# EAGLE design power_switcher (EAGLE 8.4.0)
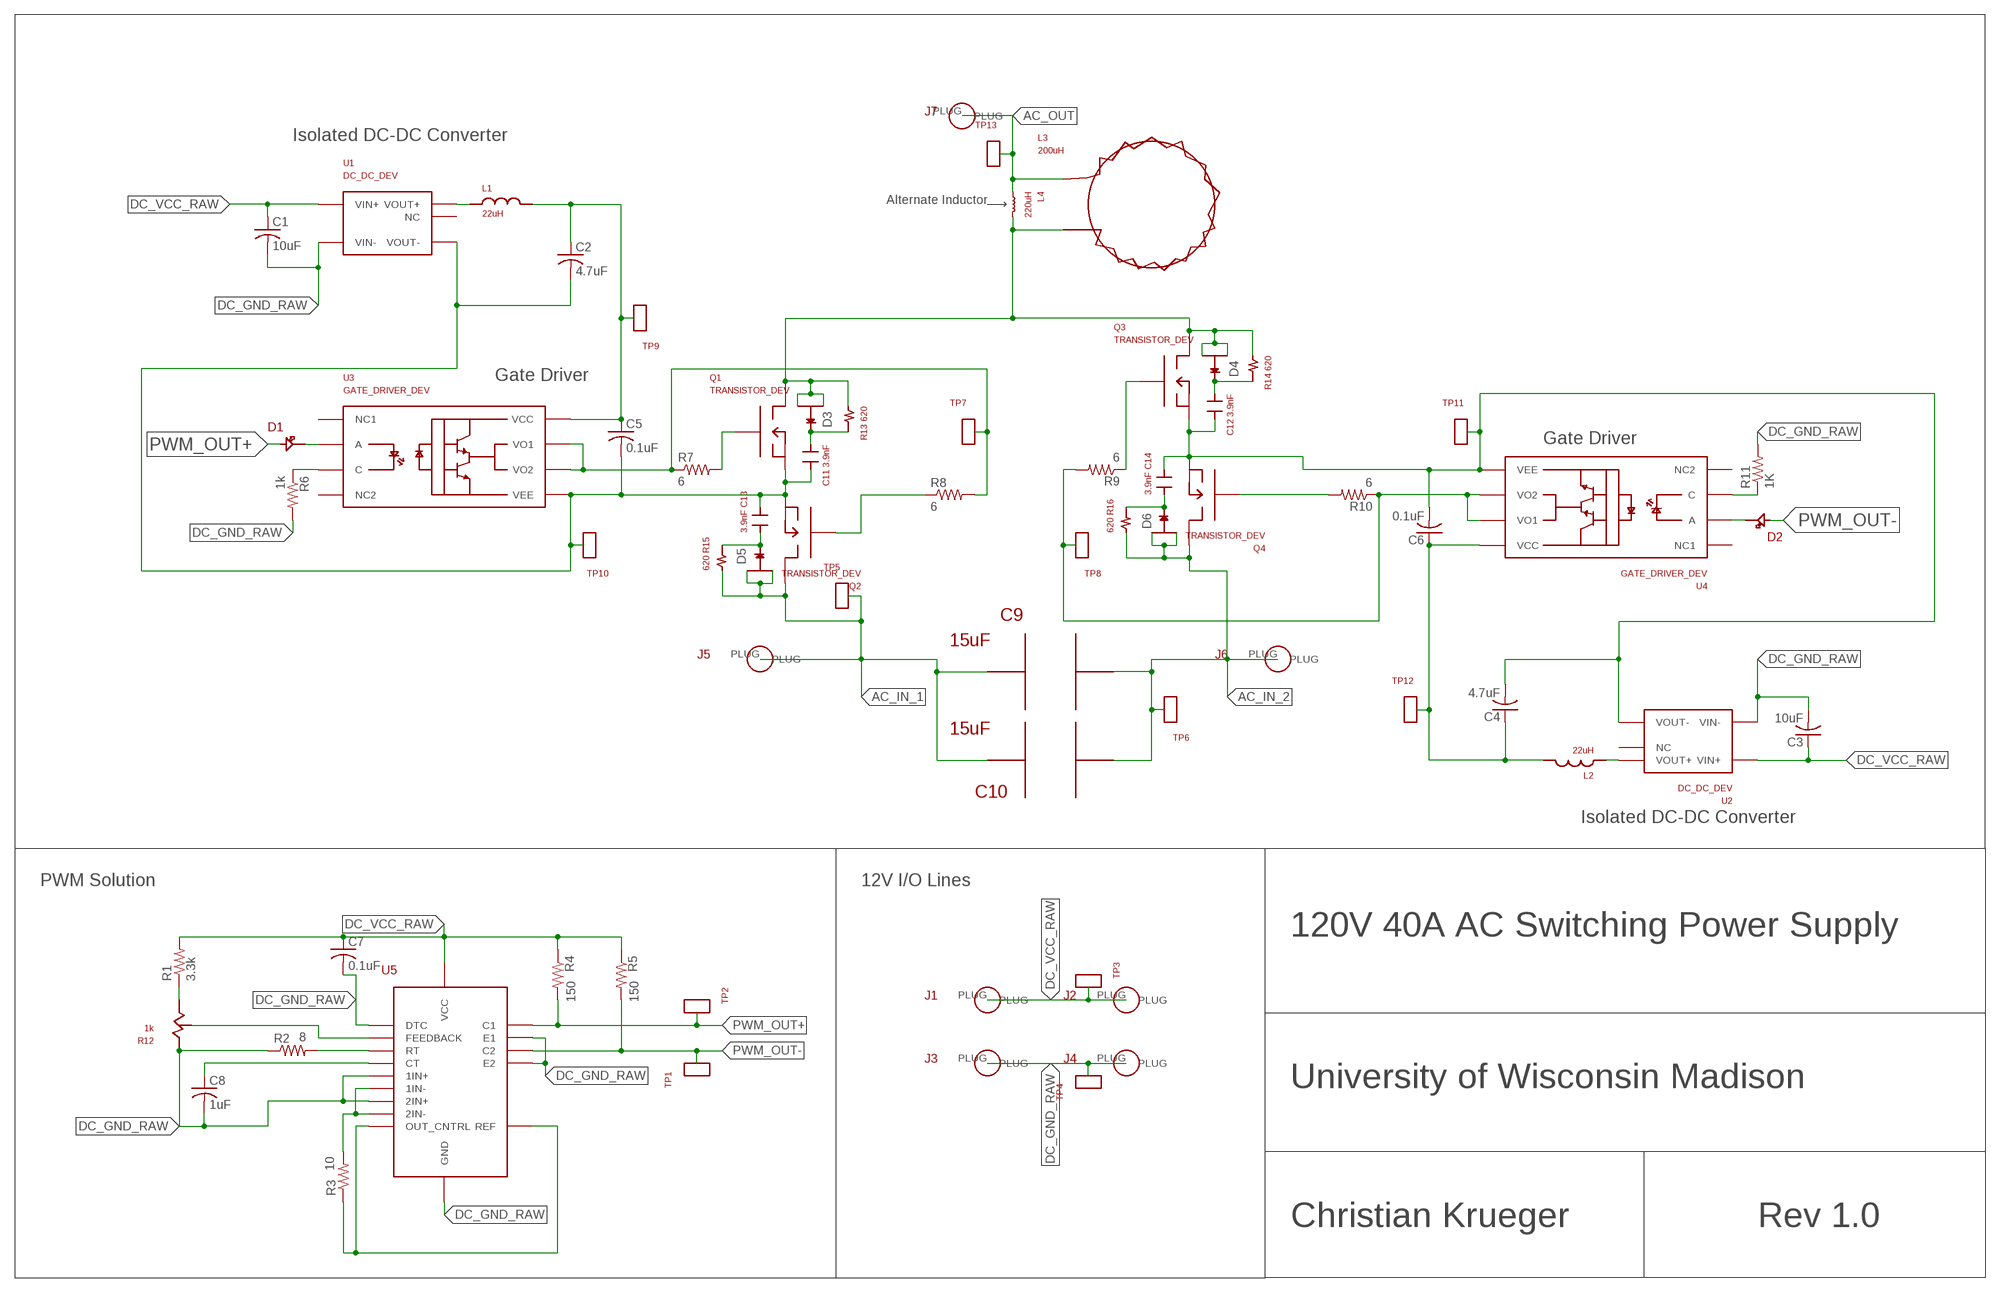
[diagram p0: schematic, sheet 1]

## Parts
C1  10uF  C-USC0805  [C0805]
C2  4.7uF  C-USC0805  [C0805]
C3  10uF  C-USC0805  [C0805]
C4  4.7uF  C-USC0805  [C0805]
C5  0.1uF  C-USC0805  [C0805]
C6  0.1uF  C-USC0805  [C0805]
C7  0.1uF  C-USC0805  [C0805]
C8  1uF  C-USC0805  [C0805]
C9  15uF  BIG_AS_CAP_DEV  [BIG_ASS_CAP_PKG]
C10  15uF  BIG_AS_CAP_DEV  [BIG_ASS_CAP_PKG]
C11  3.9nF  GEN_CAP  [0805_GEN_PKG]
C12  3.9nF  GEN_CAP  [0805_GEN_PKG]
C13  3.9nF  GEN_CAP  [0805_GEN_PKG]
C14  3.9nF  GEN_CAP  [0805_GEN_PKG]
D1  LED_DEV  [0805_PKG]
D2  LED_DEV  [0805_PKG]
D3  D2PAK_DIODE_DEV  [D2PAK_PKG]
D4  D2PAK_DIODE_DEV  [D2PAK_PKG]
D5  D2PAK_DIODE_DEV  [D2PAK_PKG]
D6  D2PAK_DIODE_DEV  [D2PAK_PKG]
J1  BANNANA_DEV  [BANNANA_PKG]
J2  BANNANA_DEV  [BANNANA_PKG]
J3  BANNANA_DEV  [BANNANA_PKG]
J4  BANNANA_DEV  [BANNANA_PKG]
J5  BANNANA_DEV  [BANNANA_PKG]
J6  BANNANA_DEV  [BANNANA_PKG]
J7  BANNANA_DEV  [BANNANA_PKG]
L1  22uH  0805IND_DEV  [0805RES_DEV]
L2  22uH  0805IND_DEV  [0805RES_DEV]
L3  200uH  BIG_ASS_INDUCTOR  [BIG_ASS_INDUCTOR_PKG]
L4  220uH  ALT_IND_DEV  [ALT_IND_PKG]
Q1  TRANSISTOR_DEV  [TRANSISTOR_PKG]
Q2  TRANSISTOR_DEV  [TRANSISTOR_PKG]
Q3  TRANSISTOR_DEV  [TRANSISTOR_PKG]
Q4  TRANSISTOR_DEV  [TRANSISTOR_PKG]
R1  3.3k  R-US_M0805  [M0805]
R2  8  R-US_M0805  [M0805]
R3  10  R-US_M0805  [M0805]
R4  150  R-US_M0805  [M0805]
R5  150  R-US_M0805  [M0805]
R6  1k  R-US_M0805  [M0805]
R7  6  R-US_M0805  [M0805]
R8  6  R-US_M0805  [M0805]
R9  6  R-US_M0805  [M0805]
R10  6  R-US_M0805  [M0805]
R11  1K  R-US_M0805  [M0805]
R12  1k  SLIDE_POT_DEV  [POT_SLIDER_PKG]
R13  620  2512_RES  [2512_PKG]
R14  620  2512_RES  [2512_PKG]
R15  620  2512_RES  [2512_PKG]
R16  620  2512_RES  [2512_PKG]
TP1  TEST_POINT  [0805_GEN_PKG]
TP2  TEST_POINT  [0805_GEN_PKG]
TP3  TEST_POINT  [0805_GEN_PKG]
TP4  TEST_POINT  [0805_GEN_PKG]
TP5  TEST_POINT  [0805_GEN_PKG]
TP6  TEST_POINT  [0805_GEN_PKG]
TP7  TEST_POINT  [0805_GEN_PKG]
TP8  TEST_POINT  [0805_GEN_PKG]
TP9  TEST_POINT  [0805_GEN_PKG]
TP10  TEST_POINT  [0805_GEN_PKG]
TP11  TEST_POINT  [0805_GEN_PKG]
TP12  TEST_POINT  [0805_GEN_PKG]
TP13  TEST_POINT  [0805_GEN_PKG]
U1  DC_DC_DEV  [DC_DC_PKG]
U2  DC_DC_DEV  [DC_DC_PKG]
U3  GATE_DRIVER_DEV  [GATE_DRIVER_PKG]
U4  GATE_DRIVER_DEV  [GATE_DRIVER_PKG]
U5  PWM_DRIVER_DEV  [PWM_DRIVER_PKG]

## Nets
AC_IN_1: C9.P$1 C10.P$1 D5.IN1 D5.IN2 J5.PLUG Q2.D(DRAIN) R15.P$1 TP5.P$1
AC_IN_2: C9.P$2 C10.P$2 D6.IN1 D6.IN2 J6.PLUG Q4.D(DRAIN) R16.P$1 TP6.P$1
AC_OUT: J7.PLUG L3.P$1 L4.P$1 TP13.P$1
DC_GND_RAW: C1.2 C3.2 C7.2 C8.2 J3.PLUG J4.PLUG R2.1 R6.2 R11.2 R12.3 TP4.P$1 U1.-VIN(VIN-) U2.-VIN(VIN-) U5.P$1(1IN+) U5.P$4(DTC) U5.P$7(GND) U5.P$9(E1) U5.P$10(E2) U5.P$16(2IN+)
DC_VCC_RAW: C1.1 C3.1 C7.1 J1.PLUG J2.PLUG R1.2 R4.1 R5.1 TP3.P$1 U1.+VIN(VIN+) U2.+VIN(VIN+) U5.P$12(VCC)
N$1: C4.1 C6.1 L2.R TP12.P$1 U4.VCC
N$2: C2.1 C5.1 L1.R TP9.P$1 U3.VCC
N$3: C4.2 C6.2 C12.P$2 C14.P$2 Q3.S(SOURCE) Q4.S(SOURCE) TP11.P$1 U2.-VOUT(VOUT-) U4.VEE
N$4: R1.1 R12.1
N$5: L2.L U2.+VOUT(VOUT+)
N$6: L1.L U1.+VOUT(VOUT+)
N$7: D1.P$2 U3.A
N$8: R12.2(VAR) U5.P$3(FEEDBACK)
N$10: R3.1 U5.P$13(OUT_CNTRL) U5.P$14(REF)
N$11: R2.2 U5.P$6(RT)
N$12: C8.1 U5.P$5(CT)
N$13: R3.2 U5.P$2(1IN-) U5.P$15(2IN-)
N$14: C2.2 C5.2 C11.P$2 C13.P$2 Q1.S(SOURCE) Q2.S(SOURCE) TP10.P$1 U1.-VOUT(VOUT-) U3.VEE
N$15: R7.1 R8.2 TP7.P$1 U3.VO1 U3.VO2
N$16: R11.1 U4.C
N$17: R6.1 U3.C
N$18: Q1.G(GATE) R7.2
N$20: Q2.G(GATE) R8.1
N$21: D2.P$2 U4.A
N$22: R9.2 R10.1 TP8.P$1 U4.VO1 U4.VO2
N$23: Q4.G(GATE) R10.2
N$24: Q3.G(GATE) R9.1
N$27: C11.P$1 D3.OUT R13.P$2
N$30: C12.P$1 D4.OUT R14.P$2
N$33: C13.P$1 D5.OUT R15.P$2
N$36: C14.P$1 D6.OUT R16.P$2
PRE_AC_OUT: D3.IN1 D3.IN2 D4.IN1 D4.IN2 L3.P$2 L4.P$2 Q1.D(DRAIN) Q3.D(DRAIN) R13.P$1 R14.P$1
PWM_OUT+: D1.P$1 R4.2 TP2.P$1 U5.P$8(C1)
PWM_OUT-: D2.P$1 R5.2 TP1.P$1 U5.P$11(C2)
Unconnected: U1.NC U2.NC U3.NC1 U3.NC2 U4.NC1 U4.NC2

## Notes on the sheet
- Isolated DC-DC Converter
- Alternate Inductor
- Gate Driver
- Gate Driver
- Isolated DC-DC Converter
- PWM Solution | 12V I/O Lines
- 120V 40A AC Switching Power Supply
- University of Wisconsin Madison
- Christian Krueger | Rev 1.0

## Library data of the parts
C1-C8 = adafruit:C-US: CAPACITOR, American symbol
C9 C10 = power_switcher:BIG_AS_CAP_DEV
C11-C14 = power_switcher:GEN_CAP
D1 D2 = power_switcher:LED_DEV
D3-D6 = blizzard_common_1:D2PAK_DIODE_DEV
J1-J7 = power_switcher:BANNANA_DEV
L1 L2 = apple:0805IND_DEV
L3 = power_switcher:BIG_ASS_INDUCTOR
L4 = power_switcher:ALT_IND_DEV
Q1-Q4 = power_switcher:TRANSISTOR_DEV
R1-R11 = adafruit:R-US_: RESISTOR, American symbol
R12 = power_switcher:SLIDE_POT_DEV
R13-R16 = power_switcher:2512_RES
TP1-TP13 = power_switcher:TEST_POINT
U1 U2 = power_switcher:DC_DC_DEV
U3 U4 = power_switcher:GATE_DRIVER_DEV
U5 = power_switcher:PWM_DRIVER_DEV

## Board
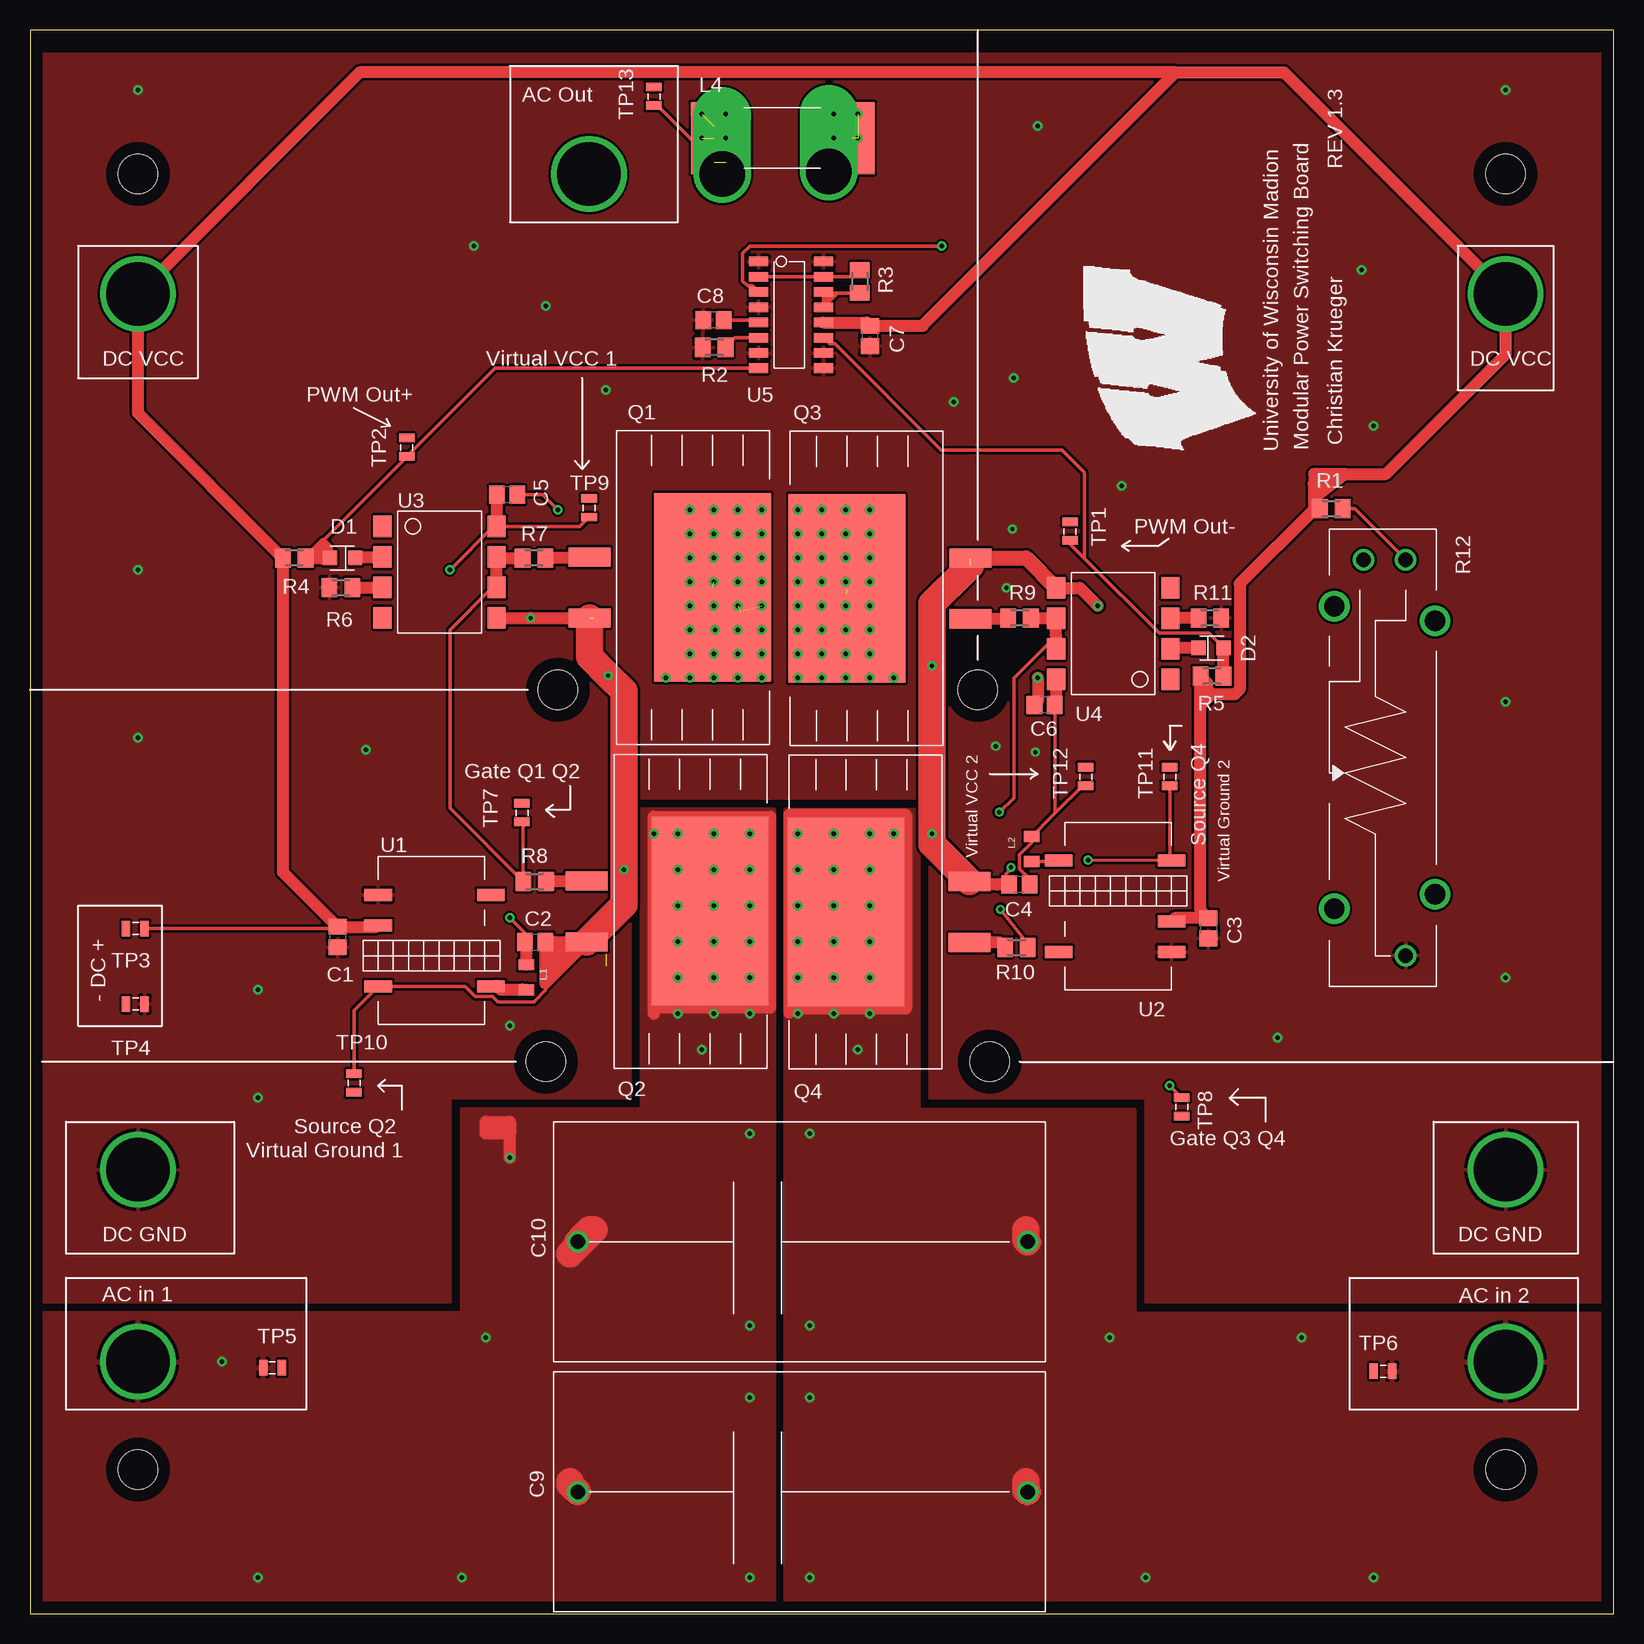
[diagram p1: board, top side]
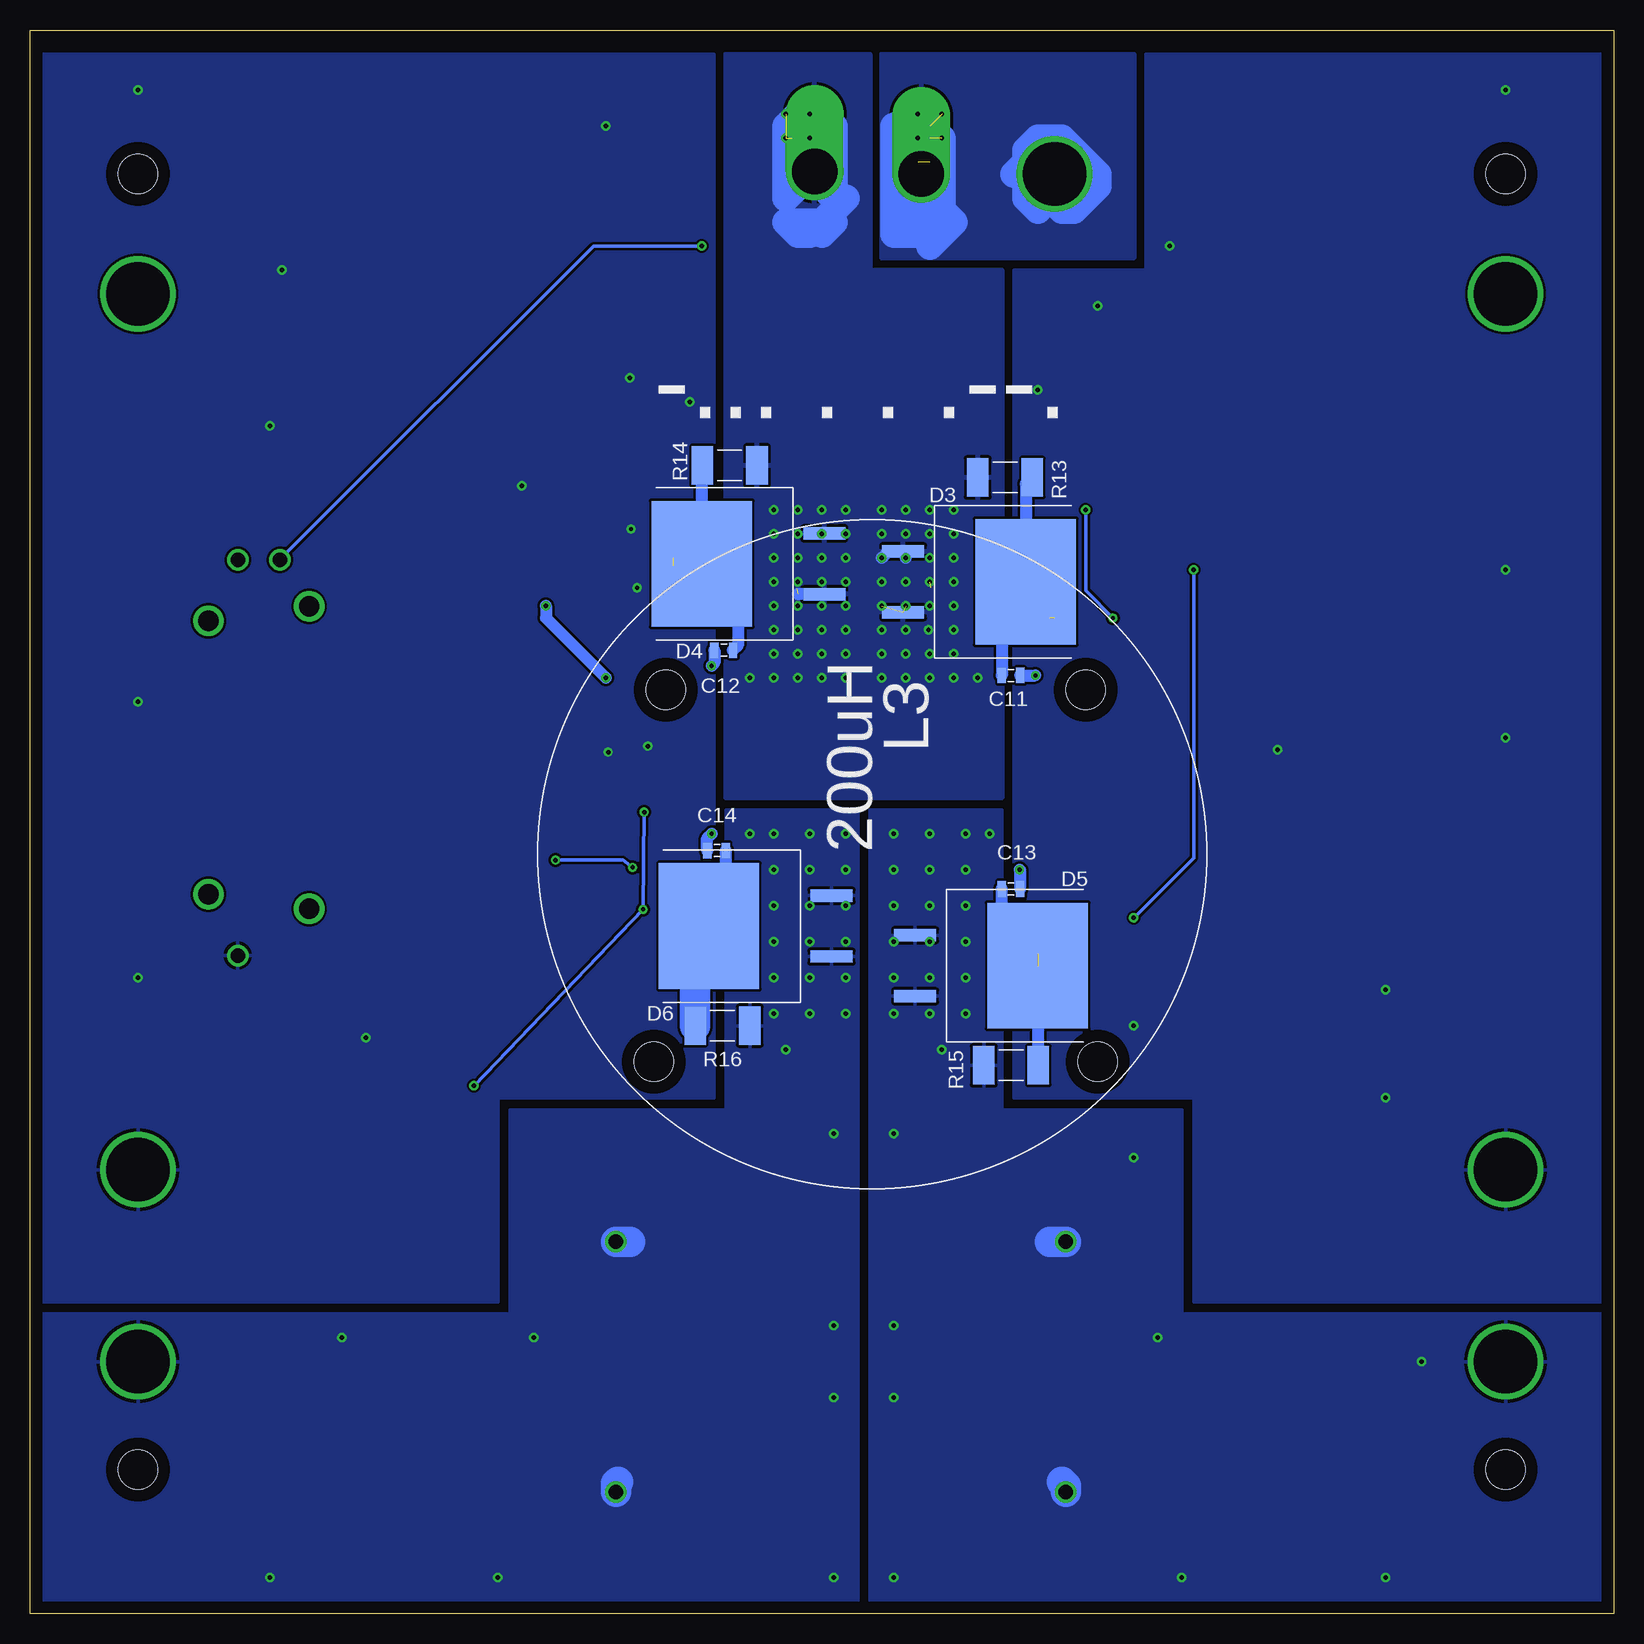
[diagram p2: board, bottom side, seen from below]

Size 132 x 132 mm. Coordinates in mm from the lower left corner, seen from the top.
Outline: 0,0 132,0 132,132 0,132 0,0
Copper layers (1*16): Top 0.035mm / dielectric 1.5mm / Bottom 0.035mm
Design rules "default *": minimum track width 10mil, minimum drill 13mil, track to track 8mil, track to pad 8mil, pad to pad 8mil, via to via 8mil, smd to smd 8mil, copper to edge 40mil, drill to drill 8mil, minimum pad ring 10mil, minimum via ring 8mil, stop-mask expansion 4mil, vias tented up to drill 0mil, thermal gap 10mil
Holes 3.3 mm at 43,46 80,46 79,77 44,77 9,12 123,12 123,120 9,120

### Footprints (pad centres in the part's own frame; a part is rotated, then mirrored left to right if it is on the bottom)
C0805 = smd 1.3 x 1.5: 1 -0.85,0; 2 0.85,0
BIG_ASS_CAP_PKG = drill 1.2: P$1 0,0; P$2 37.5,0
0805_GEN_PKG = smd 0.7 x 1.3: P$1 0,0; P$2 1.55,0
0805_PKG = smd 1.2 x 1.2: P$1 0,0; P$2 2.1,0
D2PAK_PKG = smd 1.016 x 3.504: IN1 -2.54,-10.213; IN2 2.54,-10.213 | smd 10.49 x 8.38: OUT 0,0
BANNANA_PKG = drill 5.31: PLUG 0,0
0805RES_DEV = smd 0.9 x 1.3: L -1.05,0; R 1.05,0
BIG_ASS_INDUCTOR_PKG = drill 3.8 offset: P$1 -56.7,4.1; P$2 -56.9,-4.8
ALT_IND_PKG = smd 3.8 x 6: P$1 0,0; P$2 11.5,0
TRANSISTOR_PKG = smd 9.75 x 15.7: D 0,0 | smd 3.5 x 1.6: G 10.275,-2.54; S 10.275,2.54
M0805 = smd 1.3 x 1.6: 1 -0.95,0; 2 0.95,0
POT_SLIDER_PKG = drill 1.2: 1 0,0; 2 0,-3.5; 3 33,0 | drill 1.7: P$1 5.1,2.45; P$2 27.9,2.45; P$4 3.9,-5.95; P$5 29.1,-5.95
2512_PKG = smd 1.8 x 3.2: P$1 0,0; P$2 4.55,0
DC_DC_PKG = smd 1 x 2.3: +VIN 2.54,0; +VOUT 7.62,9.4; -VIN 0,0; -VOUT 7.62,0; NC 0,9.4
GATE_DRIVER_PKG = smd 1.525 x 1.78: A 0,5.08; C 0,2.54; NC1 0,7.62; NC2 0,0; VCC 9.525,7.62; VEE 9.525,0; VO1 9.525,5.08; VO2 9.525,2.54
PWM_DRIVER_PKG = smd 0.8 x 1.6: P$1 0,0; P$2 1.27,0; P$3 2.54,0; P$4 3.81,0; P$5 5.08,0; P$6 6.35,0; P$7 7.62,0; P$8 8.89,0; P$9 8.89,5.4; P$10 7.62,5.4; P$11 6.35,5.4; P$12 5.08,5.4; P$13 3.81,5.4; P$14 2.54,5.4; P$15 1.27,5.4; P$16 0,5.4

### Placement (x,y rotation side)
C1  25.64,56.39 270 top
C2  42.11,55.99 0 top
C3  98.23,57.12 270 top
C4  82.47,60.77 180 top
C5  39.77,93.27 0 top
C6  84.58,75.73 180 top
C7  70,106.5 270 top
C8  56.97,107.81 180 top
C9  45.65,10.13 0 top
C10  45.65,31 0 top
C11  51,78.2 0 bottom
C12  73.4,80.3 180 bottom
C13  51,60.4 0 bottom
C14  74,63.6 180 bottom
D1  25,88 0 top
D2  99.5,80.5 180 top
D3  49,86 270 bottom
D4  76,87.5 90 bottom
D5  48,54 270 bottom
D6  75.4,57.3 90 bottom
J1  9,110 0 top
J2  123,110 0 top
J3  123,37 0 top
J4  9,37 0 top
J5  9,21 0 top
J6  123,21 0 top
J7  46.59,120 0 top
L1  41.36,53.03 90 top
L2  83.5,63.73 90 top
L3  61.8,63.3 270 bottom
L4  57,123 0 top
Q1  56.9,85.53 180 top
Q2  56.68,58.53 180 top
Q3  68.1,85.45 0 top
Q4  68.04,58.47 0 top
R1  108.47,92.11 180 top
R2  57.03,105.54 0 top
R3  69.16,111.03 90 top
R4  22.03,87.99 0 top
R5  98.53,78.14 0 top
R6  25.91,85.53 180 top
R7  42.01,87.97 0 top
R8  42.07,61.03 180 top
R9  82.49,82.97 0 top
R10  82.23,55.53 180 top
R11  98.35,82.97 0 top
R12  114.68,87.85 270 top
R13  53,94.7 0 bottom
R14  71.4,95.7 180 bottom
R15  52.5,45.7 0 bottom
R16  72,49 180 bottom
TP1  86.7,89.45 90 top
TP2  31.4,96.45 90 top
TP3  9.55,57.1 180 top
TP4  9.55,50.8 180 top
TP5  19.45,20.5 0 top
TP6  113.55,20.2 180 top
TP7  41,66 90 top
TP8  96,43 270 top
TP9  46.6,91.4 90 top
TP10  27,45 270 top
TP11  95,69 90 top
TP12  88,69 90 top
TP13  52,125.7 90 top
U1  29.02,59.91 270 top
U2  95.15,55.15 90 top
U3  29.37,83 0 top
U4  95.06,85.5 180 top
U5  60.74,112.7 270 top

### Tracks (layer width: path | path; a pad name or v marks a point on that pad's centre or on a via)
AC_IN_1  (via drill 0.35)
  Top 1.016: 52,50 52,66.4 61.7,66.4 61.7,50.5 52.4,50.5 52.4,51 | 40,40 40,41 38,41 38,40 40,40 | v40,38 40,40
  Top 2.3: C10.P$1 46.65,32 47,32 45,30 | C9.P$1 45,10.78 45,11
  Bottom 2.54: C10.P$1 47,31 | C9.P$1 45.65,10.65 46,11
  other vias: 52,65 60,65 60,53 54,53 54,59 60,59 57,59 57,65 57,53 36,3 16,21 19,3 60,3 60,18 60,24 60,40 56,47 38,23 60,62 57,62 54,62 54,65 60,56 57,56 54,56 54,50 57,50 60,50
  pour Top: 1,0 62,0 62,67 51,67 51,42 36,42 36,25 1,25
  pour Bottom: 62,0 62,67 51,67 51,42 36,42 36,25 1,25 1,0
AC_IN_2  (via drill 0.35)
  Top 1.016: 63.3,50.1 63.3,66.6 73,66.6 73,50.4 64,50.4 64,50.2
  Top 2.3: C9.P$2 83,10.28 83,11 | C10.P$2 83,31.15 83,32
  Bottom 2.54: C10.P$2 82,31 | C9.P$2 83.15,10.85 83,11
  other vias: 64,65 67,65 70,65 70,59 67,59 64,59 64,50 67,50 70,50 65,40 65,24 65,18 65,3 93,3 112,3 106,23 90,23 69,47 64,53 67,53 70,53 64,56 67,56 70,56 64,62 67,62 70,62 72,65
  pour Top: 63,0 63,67 74,67 74,42 92,42 92,25 131,25 131,0
  pour Bottom: 63,0 63,67 74,67 74,42 92,42 92,25 131,25 131,0
AC_OUT  (via drill 0.35)  (3 unrouted)
  Top 0.305: TP13.P$1 52.3,125.7 57,121
  Bottom 2.3: 56,122 56,117 55,116 57,114 57,116.3 L3.P$1 58,117.3 | 56,122 v56,123 57,124 60,124 60,115 58,115 59,116 59,122 56,122 | 58,117.3 58,121 | 58,117.3 58,116 | J7.PLUG 48,118.59 48,117 49,118 49,122 48,123 46,123 43,120 43,119 45,117 46,117 | 46,117 45,118 45,120 46,121 47,121 46,120 46,117 | 46,117 49,120 | 49,120 48,121 49,121 50,120 49,120
  other vias: 56,125 58,125 58,123
  pour Bottom: 61,113 61,130 40,130 40,113
DC_GND_RAW  (via drill 0.35)
  other vias: 104,48 77,101 84,124 123,127 43,109 9,127 19,43 28,72 91,94 112,99 81.9,90.4 111,112 82,103 123,76 123,53 9,73 19,52 9,87 48,102 37,114 81.4,85.5 80.5,72.3 83.8,71.8 40,49
  pour Top: 35,26 1,26 1,130 131,130 131,26 93,26 93,43 75,43 75,68 50,68 50,43 35,43
  pour Bottom: 1,130 39,130 39,112 50,112 50,43 35,43 35,26 1,26
  pour Bottom: 75,43 75,130 131,130 131,26 93,26 93,43
DC_VCC_RAW
  Top 0.305: TP3.P$1 25.5,57.1 C1.1
  Top 1.016: U1.+VIN 28.89,57.24 C1.1 21.08,61.8 R4.1 9,100.07 J1.PLUG 27.48,128.48 95.54,128.48 | 95.54,128.48 104.52,128.48 J2.PLUG 123,105 113,95 109.56,95 | 97.58,75.67 97.58,58.62 C3.1 95.43,57.97 U2.+VIN | 97.58,75.67 R5.1 98.12,77.6 98.12,77.05 98.53,76.63 | 98.53,76.63 100.42,76.63 100.84,77.05 100.84,85.84 107,92 107,94.18 107.04,94.22 | 97.58,75.67 98.53,76.63 | U5.P$12 69.73,107.62 C7.1 | C7.1 70.35,107.35 | C7.1 74.41,107.35 95.54,128.48 | 107.04,94.22 107.04,95 109,95 | 107.04,94.22 107.04,93.06 | 109.56,95 109,95 | 107.04,93.06 107.3,92.56 R1.2 | 107.04,93.06 109.56,95 | 109,95 107.04,94.22
N$1
  Top 0.305: C4.1 83.32,61.26 82.49,62.08 82.49,63.28 83.5,64.28 L2.R 85.25,66.53 85.43,66.71 | 85.43,66.71 C6.1 | TP12.P$1 87.72,69 85.43,66.71
  Top 1.016: U4.VCC 85.53,75.83 C6.1
N$2  (via drill 0.35)
  Top 0.305: v35,87 38.62,90.62 U3.VCC 45.82,90.62 TP9.P$1 | v40,58 41.36,56.64 41.36,55.89
  Top 1.016: C5.1 38.9,93.25 U3.VCC | L1.R 41.36,55.89 C2.1
  Bottom 0.305: v40,58 35,63 v35,87
N$3  (via drill 0.35)  (1 unrouted)
  Top 0.305: 94.89,62.77 U2.-VOUT | 94.89,62.77 v88.2,62.8 | v81.76,62.2 81.76,62.11 80.62,60.77 | TP11.P$1 95,62.88 94.89,62.77
  Top 1.016: C4.2 80.62,60.77 78.56,60.77 Q4.S | U4.VEE 87.5,85.5 v89,84 | v84,78 84,76 C6.2
  Top 1.27: Q3.S 83.05,87.99 U4.VEE
  Top 2.3: Q4.S 75.18,64.14 v75.18,65 v75.18,79 75.18,84.18 78,87 78.38,87.38
  Bottom 0.305: v88.2,62.8 82.56,62.8 v81.76,62.2
  Bottom 1.016: v89,84 89,83 v84,78 | C14.P$2 75.55,64.63 v75.18,65 | C12.P$2 74.95,79.23 v75.18,79
N$4
  Top 0.305: 109.68,91.85 R1.1 110.42,92.11 R12.1
N$5
  Top 0.305: U2.+VOUT 85.66,62.68 L2.L
N$6
  Top 0.508: U1.+VOUT 41.05,52.29 L1.L
  Top 1.016: L1.L 39.24,51.98 38.92,52.3 38.79,52.3
N$7
  Top 1.016: D1.P$2 27.18,88.08 U3.A
N$8  (via drill 0.35)
  Top 0.305: U5.P$3 60.23,110.67 59.79,110.67 59.4,111.07 59.4,113.4 60,114 v76,114
  Bottom 0.305: v76,114 85.03,114 R12.2
N$10
  Top 0.305: U5.P$13 U5.P$14 | 67.05,109.8 U5.P$13 | 67.05,109.8 67.33,110.08 R3.1 66.62,110.08 | U5.P$14 66.22,110.08 66.4,110.08 | 66.62,110.08 66.4,110.08 | U5.P$13 66.4,109.15 66.4,110.08 | U5.P$13 66.62,109.37 66.62,110.08 | U5.P$14 66.5,109.8 67.05,109.8
N$11
  Top 0.305: R2.2 58.79,106.35 U5.P$6
N$12
  Top 0.305: U5.P$5 60.55,107.81 C8.1
N$13
  Top 0.305: R3.2 68.61,111.43 U5.P$15 U5.P$2
N$14  (via drill 0.35)  (1 unrouted)
  Top 0.305: 42.96,53 42.96,51.96 42,51 39,51 38.57,51.43 37.12,51.43 36.27,52.29 U1.-VOUT 27,50.27 TP10.P$1 | C5.2 42.73,93.27 v44,92
  Top 1.016: U3.VEE v41.74,82.99 v41.75,83 47,83 | 43.63,55.99 C2.2 42.96,53 | 43.63,55.99 Q2.S | C5.2 40.55,93.34 | 42.96,53 42.96,52.55 Q2.S | 42.96,53 43.63,53.67 43.63,54.63 | 43.63,54.63 43.63,55.99 | Q2.S 45.41,55 44,55 43.63,54.63
  Top 2.3: Q1.S 46.62,79.77 v48.2,78.2 49.51,76.89 v49.51,62 49.51,59.09 Q2.S
  Bottom 0.305: v44,92 44,85.25 v41.74,82.99
  Bottom 1.016: C13.P$2 49.45,61.94 v49.51,62 | C11.P$2 v48.2,78.2
N$15
  Top 0.305: U3.VO2 38.54,85.54 35,82 35,67.15 R8.2 41.12,65.88 TP7.P$1
  Top 1.016: U3.VO2 U3.VO1 39.01,87.97 R7.1
N$16
  Top 1.016: R11.1 U4.C
N$17
  Top 1.016: R6.1 U3.C
N$18
  Top 1.016: Q1.G 46.52,87.97 R7.2
N$20
  Top 1.016: Q2.G 46.37,61.03 R8.1
N$21
  Top 1.016: D2.P$2 95.14,80.5 U4.A
N$22  (via drill 0.35)
  Top 0.305: v80.9,58.7 83.18,55.82 R10.1 83,55.35 | v80.8,66.8 82,68 82,78 85,81 85.02,81 85.53,81.52 | TP8.P$1 v95,44
  Top 1.016: R9.2 U4.VO2 85.53,81.52 U4.VO1
  Bottom 0.305: v80.8,66.8 v80.9,58.7 v95,44
N$23
  Top 1.016: R10.2 80.88,55.93 Q4.G
N$24
  Top 1.016: R9.1 81.48,82.91 Q3.G
N$27
  Bottom 1.016: R13.P$2 49,94.15 D3.OUT 49,83 51,81 C11.P$1
N$30
  Bottom 1.016: C12.P$1 73,80.7 73,83 76,86 D4.OUT 76,95.65 R14.P$2
N$33  (1 unrouted)
  Bottom 1.016: R15.P$2 47.95,52.95 48,53 48,55 51,58 C13.P$1
N$36
  Bottom 1.016: 76,56 76,55 | 76,56 76,60 74,62 C14.P$1 | D6.OUT 75.4,56.6 76,56
  Bottom 2.54: R16.P$2 76.55,54.45 76,55
PRE_AC_OUT  (via drill 0.35)  (7 unrouted)
  Bottom 1.016: v61,88 60.46,88.54 D3.IN1 59,88.33 v59,88 | D4.IN1 67.96,84.96 68,85
  Bottom 2.3: L3.P$2 65,118.8 65,124 69,124 | 68,125 69,124 | 69,124 69,118 | 69,118 67,120 v67,123 66,122 66,119 65,118 64,118 66,116 | 66,116 69,116 68,115 67,115 66,116 | 66,116 65,116 66,115 | 69,124 69,118
  other vias: 55,92 57,92 59,92 61,92 61,90 59,90 57,90 55,90 57,88 61,86 59,86 57,86 55,86 55,80 55,84 61,82 59,82 55,82 57,80 59,80 61,80 61,78 59,78 57,78 55,78 53,78 64,92 66,92 68,92 70,92 70,90 64,88 66,88 68,88 70,88 68,82 70,80 70,84 70,82 66,82 64,82 64,80 66,80 68,80 72,78 70,78 68,78 66,78 64,78 55,88 57.1,82 68,84 66,84 64,84 64,86 66,86 68,86 70,86 68,90 66,90 64,90 61,84 59,84 57,84 67,125 69,125 69,123
  pour Bottom: 51,68 74,68 74,130 62,130 62,112 51,112
PWM_OUT+
  Top 0.305: R4.2 23.65,88.66 23.91,88.92 24.21,89.22 24.42,89.43 31.4,96.41 TP2.P$1 38.76,103.81 U5.P$8
  Top 0.508: D1.P$1 24.31,88 23.65,88.66 | D1.P$1 24.82,88 23.91,88.92 | D1.P$1 25,88.44 24.21,89.22 | D1.P$1 25,88.85 24.42,89.43 R4.2
  Top 1.016: R4.2 D1.P$1
PWM_OUT-
  Top 0.305: 66.65,106.35 U5.P$11 66.65,105.84 67.09,105.84 75.92,97 86,97 87.91,95.09 87.91,87.95 | 87.86,88 87.91,87.95 | 87.91,87.95 94.15,81.71 98.29,81.71 99.37,80.63 D2.P$1 99.48,80.48 | 87.91,87.95 86.7,89.17 TP1.P$1
  Top 0.61: 99.48,80.48 99.48,80.52 99.37,80.63
  Top 1.016: R5.2 99.48,80.48

### Text on the board
tPlace: AC Out | REV 1.3 | DC VCC | Virtual VCC 1 | DC VCC | PWM Out+ | University of Wisconsin Madion | Modular Power Switching Board | Christian Krueger | PWM Out- | Gate Q1 Q2 | Source Q4 | Virtual VCC 2 | Virtual Ground 2 | - DC + | Source Q2 | Gate Q3 Q4 | Virtual Ground 1 | DC GND | DC GND | AC in 1 | AC in 2